# Altium schematic sheet Programming Jack.SchDoc
size A4; DrawnBy: Craig Comberbach; DocumentNumber: 3; Revision: A1; SheetNumber: 3; SheetTotal: 7
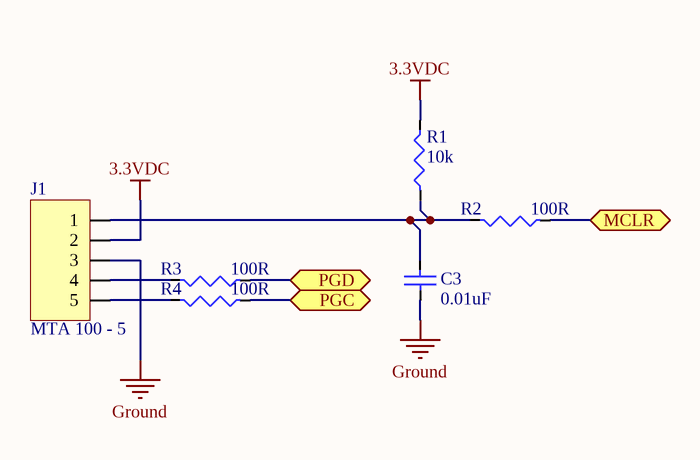
[diagram p0: Programming Jack.SchDoc]

## Parts
C3  QuickValue: 0.01uF  [Capacitor - 0603]  (hidden comment: Capacitor (Non-polarized))
J1  QuickValue: MTA 100 - 5  [MTA-100-5P]  (hidden comment: Flash connector, 5 Position)
R1  QuickValue: 10k  [RESISTOR THT 3W 0.05HOLE 900MIL]  (hidden comment: Resistor)
R2  QuickValue: 100R  [Resistor - 0603]  (hidden comment: Resistor)
R3  QuickValue: 100R  [Resistor - 0603]  (hidden comment: Resistor)
R4  QuickValue: 100R  [Resistor - 0603]  (hidden comment: Resistor)

## Ports
MCLR (bidir), PGC (bidir), PGD (bidir)

## Nets
3.3VDC: J1.2 R1.2
Ground: C3.2 J1.3
MCLR: R2.1 ; port MCLR
PGC: R4.1 ; port PGC
PGD: R3.1 ; port PGD
NetC3_1: C3.1 J1.1 R1.1 R2.2
NetJ1_4: J1.4 R3.2
NetJ1_5: J1.5 R4.2

## Library data of the parts
C3 = Capacitor (Non-polarized): Non-polarized; Value: 0.01uF 0603 10% 50V; Tolerance: 10%; Voltage: 50V; Technology: THT; Supplier 1: Digi-Key; Supplier Part Number 1: 399-4206-ND; Package: Radial
J1 = Flash connector, 5 Position: Flash header; Value: MTA 100 - 5 Position Connector, Verticle, Friction Lock; Technology: THT; Package: MTA-100; Supplier 1: Digi-Key; Supplier Part Number 1: A19471-ND
R1 = Resistor: Value: 10k 1/4W 1%; Tolerance: 1%; Technology: THT; Supplier 1: Digi-Key; Supplier Part Number 1: 10.0KXBK-ND; Package: 1/4W
R2-R4 = Resistor: Value: 100R 1/4W 1%; Tolerance: 1%; Technology: THT; Supplier 1: Digi-Key; Supplier Part Number 1: 100XBK-ND; Package: 1/4W